# Altium schematic sheet IDE_44m_to_44m.SchDoc
size A3; SheetNumber: 1; SheetTotal: 1
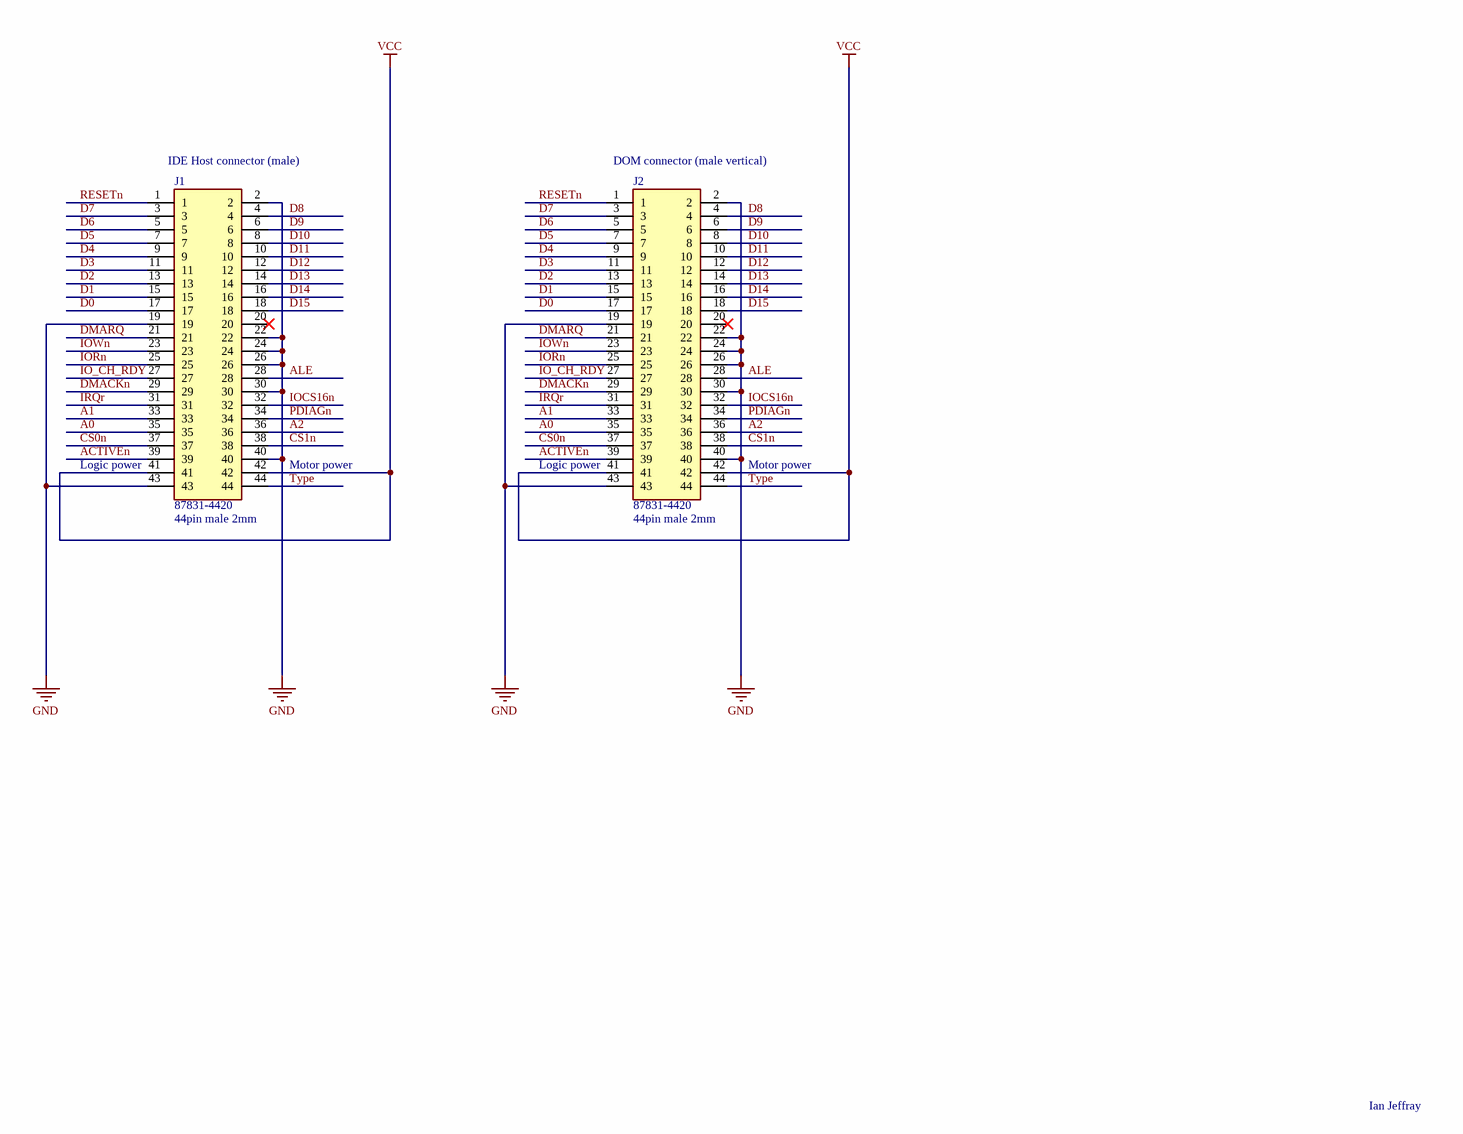
[diagram p0: IDE_44m_to_44m.SchDoc]

## Parts
J1  87831-4420  value 44pin male 2mm  [SHDR44W55P200_2X22_4665X630X640P]
J2  87831-4420  value 44pin male 2mm  [SHDR44W55P200_2X22_4665X630X640P]

## Nets
GND: J1.2 J1.19 J1.22 J1.24 J1.26 J1.30 J1.40 J1.43 J2.2 J2.19 J2.22 J2.24 J2.26 J2.30 J2.40 J2.43
VCC: J1.41 J1.42 J2.41 J2.42
A0: J1.35 J2.35
A1: J1.33 J2.33
A2: J1.36 J2.36
ACTIVEn: J1.39 J2.39
ALE: J1.28 J2.28
CS0n: J1.37 J2.37
CS1n: J1.38 J2.38
D0: J1.17 J2.17
D1: J1.15 J2.15
D2: J1.13 J2.13
D3: J1.11 J2.11
D4: J1.9 J2.9
D5: J1.7 J2.7
D6: J1.5 J2.5
D7: J1.3 J2.3
D8: J1.4 J2.4
D9: J1.6 J2.6
D10: J1.8 J2.8
D11: J1.10 J2.10
D12: J1.12 J2.12
D13: J1.14 J2.14
D14: J1.16 J2.16
D15: J1.18 J2.18
DMACKn: J1.29 J2.29
DMARQ: J1.21 J2.21
IO_CH_RDY: J1.27 J2.27
IOCS16n: J1.32 J2.32
IORn: J1.25 J2.25
IOWn: J1.23 J2.23
IRQr: J1.31 J2.31
PDIAGn: J1.34 J2.34
RESETn: J1.1 J2.1
Type: J1.44 J2.44

Not connected (* = marked no-connect by the designer): J1 20*; J2 20*

## Notes on the sheet
- (near J1) IDE Host connector (male)
- (near J2) DOM connector (male vertical)
- (near J1) Logic power
- (near J1) Motor power
- (near J2) Logic power
- (near J2) Motor power
- Ian Jeffray
- SIZE
- CODION LTD
- DIMENSIONS
- TITLE
- VARIANT
- REVISION
- DATE
- A3
- SHEET
- OF
- FILE
- DRAWN BY

## Library data of the parts
J1 J2 = 87831-4420: Drive connector; Manufacturer_Name: Molex; Datasheet Link: https://datasheet.datasheetarchive.com/originals/distributors/Datasheets-DGA22/2095109.pdf; Height: 6.4mm; Manufacturer_Part_Number: 87831-4420; Mouser Part Number: 538-87831-4420; Mouser Price/Stock: https://www.mouser.co.uk/ProductDetail/Molex/87831-4420?qs=tYx%252BZc2nXqqGnHzye8Wn9w%3D%3D